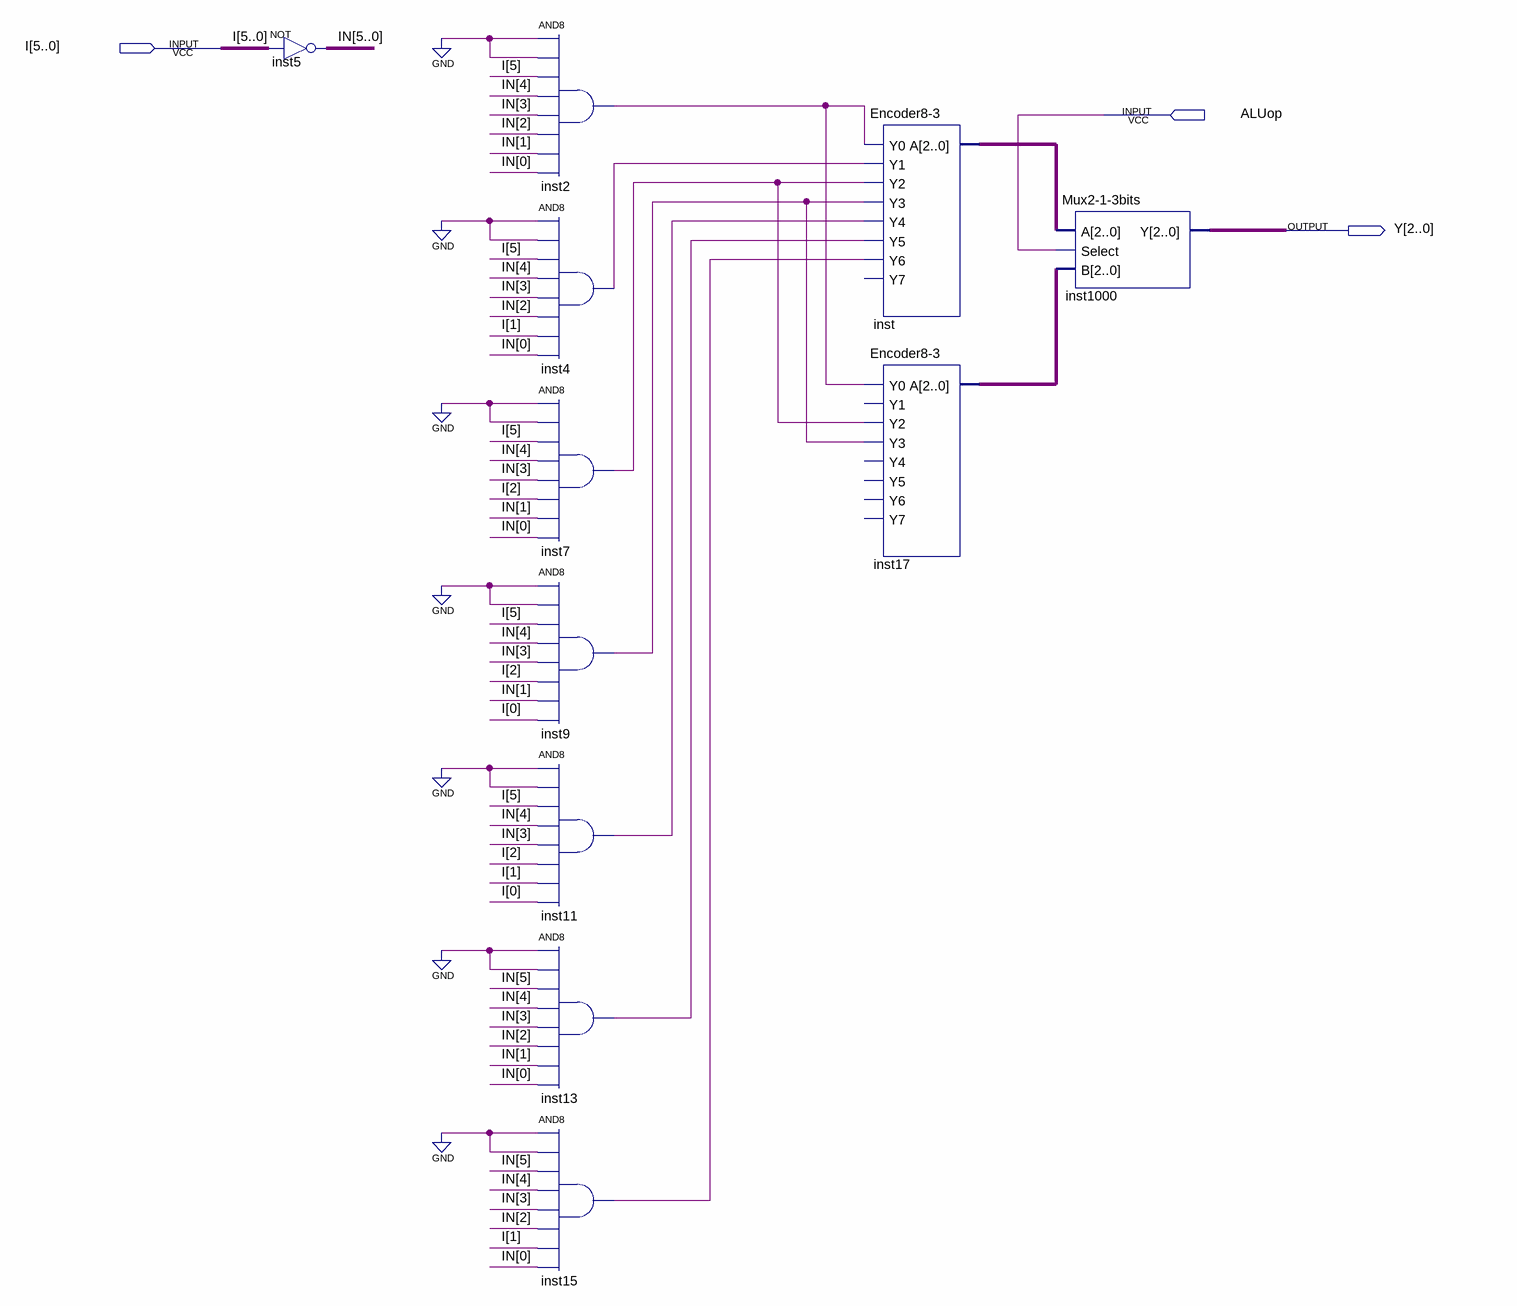
[diagram p0: schematic sheet]
// Quartus schematic ALU-Control.bdf as structural Verilog: 11 symbols, 3 pins
module \ALU-Control  (
  input  [5:0] I,
  input  ALUop,
  output [2:0] Y
);

  wire inst2_out, inst4_out, inst7_out, inst9_out, inst11_out, inst13_out, inst15_out;
  wire [2:0] inst17_a, inst_a;
  wire [5:0] IN;

  assign IN = ~I;  // NOT inst5, 6 bits wide
  and inst2 (inst2_out, 1'b0, 1'b0, I[5], IN[4], IN[3], IN[2], IN[1], IN[0]);
  and inst4 (inst4_out, 1'b0, 1'b0, I[5], IN[4], IN[3], IN[2], I[1], IN[0]);
  and inst7 (inst7_out, 1'b0, 1'b0, I[5], IN[4], IN[3], I[2], IN[1], IN[0]);
  and inst9 (inst9_out, 1'b0, 1'b0, I[5], IN[4], IN[3], I[2], IN[1], I[0]);
  and inst11 (inst11_out, 1'b0, 1'b0, I[5], IN[4], IN[3], I[2], I[1], I[0]);
  and inst13 (inst13_out, 1'b0, 1'b0, IN[5], IN[4], IN[3], IN[2], IN[1], IN[0]);
  and inst15 (inst15_out, 1'b0, 1'b0, IN[5], IN[4], IN[3], IN[2], I[1], IN[0]);
  \Encoder8-3  inst (
    .Y0(inst2_out), .Y1(inst4_out), .Y2(inst7_out), .Y3(inst9_out), .Y4(inst11_out), .Y5(inst13_out),
    .Y6(inst15_out), .A(inst_a));  // open: Y7
  \Encoder8-3  inst17 (.Y0(inst2_out), .Y2(inst7_out), .Y3(inst9_out), .A(inst17_a));  // open: Y1, Y4, Y5, Y6, Y7
  \Mux2-1-3bits  inst1000 (.A(inst_a), .Select(ALUop), .B(inst17_a), .Y(Y));
endmodule
